# Altium project Shape_Test.PrjPcb
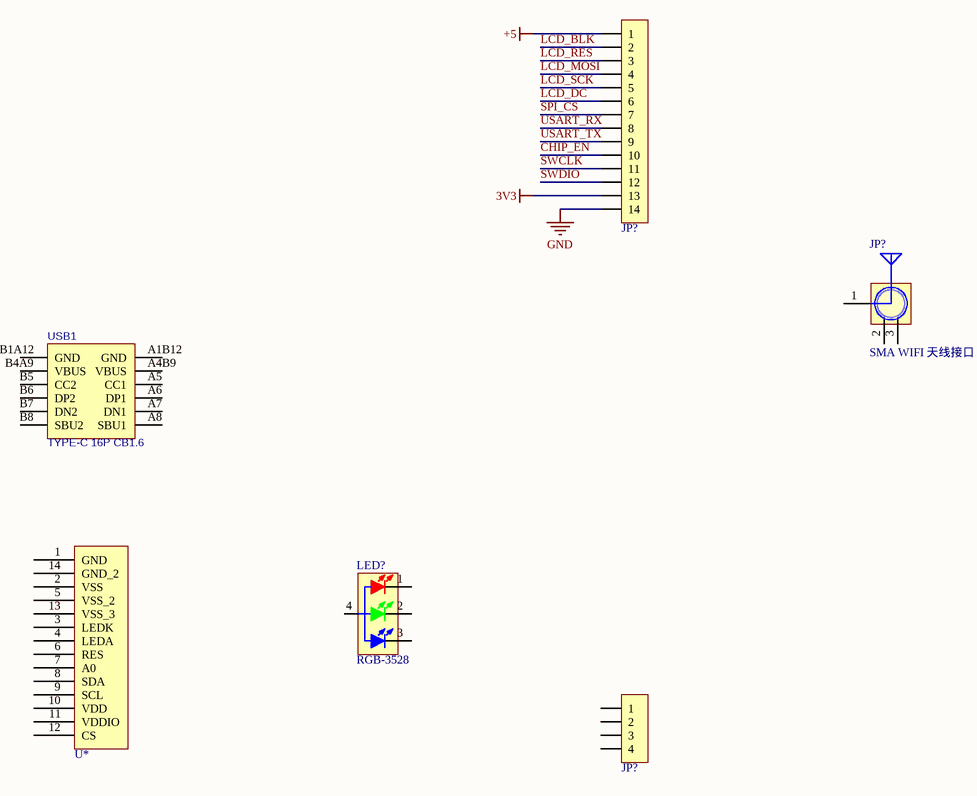
[diagram p0: Shape_Test.SchDoc]
1 sheet, 6 parts. Net scope: global (net labels, ports and power ports of the same name join across sheets).
Board file: Shape_Test.PcbDoc

## Sheet Shape_Test.SchDoc
size A0; SheetNumber: 1; SheetTotal: 1

### Parts
(Parts that share a designator on the sheet are numbered #1, #2 ... from top to bottom, then left to right.)
JP?#1  FH34SRJ-14S-0.5SH(50)  [FH34SRJ-14S-0.5SH(50)]  (value not drawn)
JP?#2  SMA WIFI 天线接口  [SMA-KE]
JP?#3  HDR-1X4  [MX 1.25-WS-4P]  (value not drawn)
LED?  RGB-3528  [LED 3528-4Pin]
U*  SPI-1.44-14  [FPC-0.8-14P]  (value not drawn)
USB1  TYPE-C 16P CB1.6  [Type-C  16PIN]

### Nets
3V3: JP?#1.13
+5: JP?#1.1
GND: JP?#1.14
CHIP_EN: JP?#1.10
LCD_BLK: JP?#1.2
LCD_DC: JP?#1.6
LCD_MOSI: JP?#1.4
LCD_RES: JP?#1.3
LCD_SCK: JP?#1.5
SPI_CS: JP?#1.7
SWCLK: JP?#1.11
SWDIO: JP?#1.12
USART_RX: JP?#1.8
USART_TX: JP?#1.9

Not connected (* = marked no-connect by the designer): JP?#2 1(ANT) 2(GND) 3(GND); JP?#3 1 2 3 4; LED? 1(RED_K) 2(GREEN_K) 3(BULE_K) 4(A); U* 1(GND) 2(VSS) 3(LEDK) 4(LEDA) 5(VSS_2) 6(RES) 7(A0) 8(SDA) 9(SCL) 10(VDD) 11(VDDIO) 12(CS) 13(VSS_3) 14(GND_2); USB1 A1B12(GND) A4B9(VBUS) A5(CC1) A6(DP1) A7(DN1) A8(SBU1) B1A12(GND) B4A9(VBUS) B5(CC2) B6(DP2) B7(DN2) B8(SBU2)

### Library data of the parts
JP?#1 = FH34SRJ-14S-0.5SH(50): C324724
JP?#2 = SMA: SMA-2.4G射频天线接口; 联系卖家，免费技术支持: 唯一出售店铺网址https://shop463601444.taobao.com; BOM名称: SMA-2.4G射频天线接口
JP?#3 = Header 4: 4P接插件; 联系卖家，免费技术支持: 唯一出售店铺网址https://shop463601444.taobao.com; BOM名称: 4P接插件
LED? = LED-RGB 3528: 3528三基色LED; BOM名称: 三基色LED; 封装库来自淘宝卖家 ID：黄晶宝石: 其他店铺购入均为盗版，不享受售后技术支持服务，请立即申请退款
USB1 = TYPE-C 16P CB1.6: 沉板1.6; BOM_Manufacturer: SHOU HAN(首韩); Contributor: LCSC; BOM_Supplier: LCSC; BOM_Supplier Part: C2681554; BOM_Manufacturer Part: TYPE-C 16P CB1.6; BOM_JLCPCB Part Class: Extended Part; spicePre: U; spiceSymbolName: TYPE-C 16P CB1.6